# Altium schematic sheet Enet.SchDoc
size B; SheetNumber: 0; SheetTotal: 0
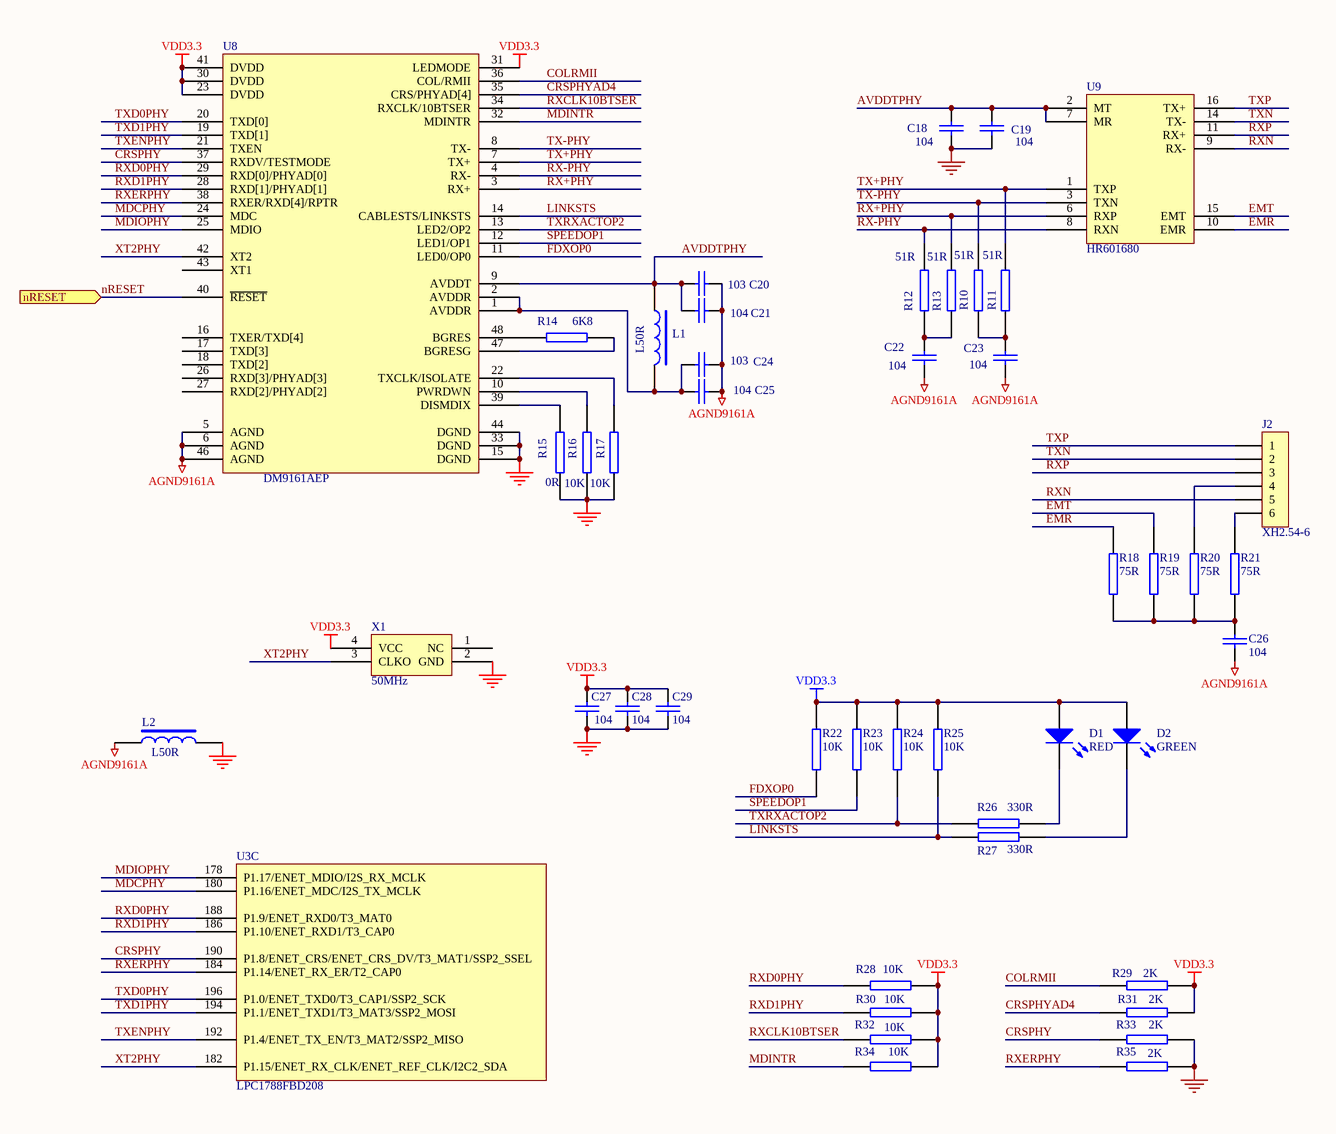
[diagram p0: Enet.SchDoc]

## Parts
C18  104  [C0603]
C19  104  [C0603]
C20  103  [C0603]
C21  104  [C0603]
C22  104  [C0603]
C23  104  [C0603]
C24  103  [C0603]
C25  104  [C0603]
C26  104  [C0603]
C27  104  [C0603]
C28  104  [C0603]
C29  104  [C0603]
D1  RED  [LED0603]
D2  GREEN  [LED0603]
J2  XH2.54-6  [A2501WF-06A]
L1  L50R  [BEADL]
L2  L50R  [BEADL]
R10  51R  [R0603]
R11  51R  [R0603]
R12  51R  [R0603]
R13  51R  [R0603]
R14  6K8  [R0603]
R15  0R  [R0603]
R16  10K  [R0603]
R17  10K  [R0603]
R18  75R  [R0603]
R19  75R  [R0603]
R20  75R  [R0603]
R21  75R  [R0603]
R22  10K  [R0603]
R23  10K  [R0603]
R24  10K  [R0603]
R25  10K  [R0603]
R26  330R  [R0603]
R27  330R  [R0603]
R28  10K  [R0603]
R29  2K  [R0603]
R30  10K  [R0603]
R31  2K  [R0603]
R32  10K  [R0603]
R33  2K  [R0603]
R34  10K  [R0603]
R35  2K  [R0603]
U3  LPC1788FBD208  [QFP208]  (part C of 8)
U8  DM9161AEP  [PQFP48]
U9  HR601680  [HR601680]
X1  50MHz  [CRYSTAL5X8]

## Ports
nRESET (in)

## Nets
AGND9161A: C20.2 C21.2 C22.1 C23.1 C24.2 C25.2 C26.2 L2.1 U8.5(AGND) U8.6(AGND) U8.46(AGND)
GND: C18.1 C19.1 C27.2 C28.2 C29.2 L2.2 R15.1 R16.1 R17.1 R33.2 R35.2 U8.15(DGND) U8.33(DGND) U8.44(DGND) X1.2(GND)
NC: U8.45(NC) U9.4(NC) U9.5(NC) U9.12(NC) U9.13(NC)
VDD3.3: C27.1 C28.1 C29.1 D1.1(A) D2.1(A) R22.2 R23.2 R24.2 R25.2 R28.2 R29.2 R30.2 R31.2 R32.2 R34.2 U8.23(DVDD) U8.30(DVDD) U8.31(LEDMODE) U8.41(DVDD) X1.4(VCC)
AVDDTPHY: C18.2 C19.2 C20.1 C21.1 L1.1 U8.9(AVDDT) U9.2(MT) U9.7(MR)
COLRMII: R29.1 U8.36(COL/RMII)
CRSPHY: R33.1 U3.190(P1.8/ENET_CRS/ENET_CRS_DV/T3_MAT1/SSP2_SSEL) U8.37(RXDV/TESTMODE)
CRSPHYAD4: R31.1 U8.35(CRS/PHYAD[4])
EMR: R18.2 U9.10(EMR)
EMT: R19.2 U9.15(EMT)
FDXOP0: R22.1 U8.11(LED0/OP0)
LINKSTS: R25.1 R27.1 U8.14(CABLESTS/LINKSTS)
MDCPHY: U3.180(P1.16/ENET_MDC/I2S_TX_MCLK) U8.24(MDC)
MDINTR: R34.1 U8.32(MDINTR)
MDIOPHY: U3.178(P1.17/ENET_MDIO/I2S_RX_MCLK) U8.25(MDIO)
nRESET: U8.40(~{RESET}) ; port nRESET
RX+PHY: R13.2 U8.3(RX+) U9.6(RXP)
RX-PHY: R12.2 U8.4(RX-) U9.8(RXN)
RXCLK10BTSER: R32.1 U8.34(RXCLK/10BTSER)
RXD0PHY: R28.1 U3.188(P1.9/ENET_RXD0/T3_MAT0) U8.29(RXD[0]/PHYAD[0])
RXD1PHY: R30.1 U3.186(P1.10/ENET_RXD1/T3_CAP0) U8.28(RXD[1]/PHYAD[1])
RXERPHY: R35.1 U3.184(P1.14/ENET_RX_ER/T2_CAP0) U8.38(RXER/RXD[4]/RPTR)
RXN: J2.5 U9.9(RX-)
RXP: J2.3 U9.11(RX+)
SPEEDOP1: R23.1 U8.12(LED1/OP1)
TX+PHY: R11.2 U8.7(TX+) U9.1(TXP)
TX-PHY: R10.2 U8.8(TX-) U9.3(TXN)
TXD0PHY: U3.196(P1.0/ENET_TXD0/T3_CAP1/SSP2_SCK) U8.20(TXD[0])
TXD1PHY: U3.194(P1.1/ENET_TXD1/T3_MAT3/SSP2_MOSI) U8.19(TXD[1])
TXENPHY: U3.192(P1.4/ENET_TX_EN/T3_MAT2/SSP2_MISO) U8.21(TXEN)
TXN: J2.2 U9.14(TX-)
TXP: J2.1 U9.16(TX+)
TXRXACTOP2: R24.1 R26.1 U8.13(LED2/OP2)
XT2PHY: U3.182(P1.15/ENET_RX_CLK/ENET_REF_CLK/I2C2_SDA) U8.42(XT2) X1.3(CLKO)
NetC22_2: C22.2 R12.1 R13.1
NetC23_2: C23.2 R10.1 R11.1
NetC24_1: C24.1 C25.1 L1.2 U8.1(AVDDR) U8.2(AVDDR)
NetC26_1: C26.1 R18.1 R19.1 R20.1 R21.1
NetD1_2: D1.2(K) R26.2
NetD2_2: D2.2(K) R27.2
NetJ2_4: J2.4 R20.2
NetJ2_6: J2.6 R21.2
NetR14_1: R14.1 U8.47(BGRESG)
NetR14_2: R14.2 U8.48(BGRES)
NetR15_2: R15.2 U8.39(DISMDIX)
NetR16_2: R16.2 U8.10(PWRDWN)
NetR17_2: R17.2 U8.22(TXCLK/ISOLATE)

Not connected (* = marked no-connect by the designer): U8 16(TXER/TXD[4]) 17(TXD[3]) 18(TXD[2]) 26(RXD[3]/PHYAD[3]) 27(RXD[2]/PHYAD[2]) 43(XT1); X1 1(NC)

## Library data of the parts
C18-C29 = CAP: Capacitor
D1 D2 = LED0: Typical INFRARED GaAs LED; Published: 8-Jun-2000; LatestRevisionDate: 08-Jul-2005; LatestRevisionNote: Mech Layer 1 removed.; PackageReference: LED-0; Publisher: Altium Limited
J2 = XH2.54-6-SMD
L1 L2 = INDUCTOR2
R10-R35 = RES2
U8 = DM9161A
X1 = OSCILLATOR